# EAGLE schematic led-regulator (EAGLE 6.4)
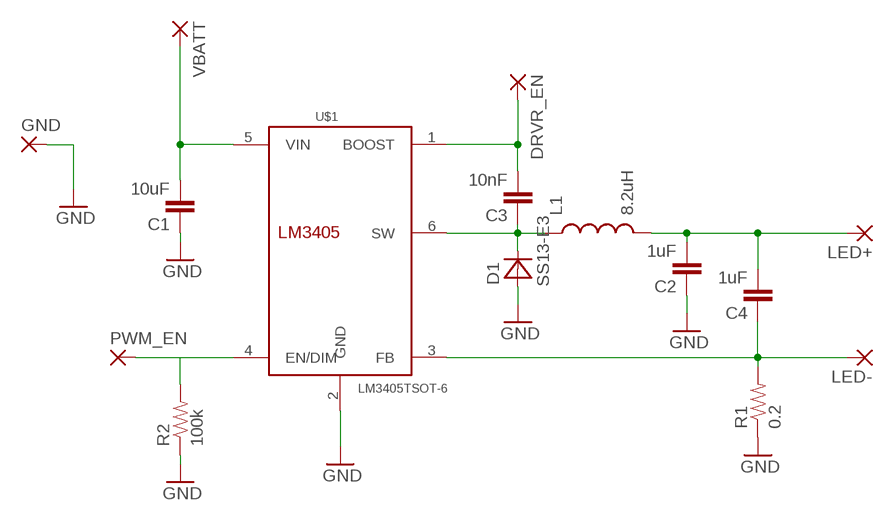
[diagram p0: schematic, sheet 1]

## Parts
C1  10uF  CAP1206  [1206]
C2  1uF  CAP1206  [1206]
C3  10nF  CAP0805  [0805]
C4  1uF  CAP0805  [0805]
D1  SS13-E3  MBRA340T3  [SMA]
DRVR_EN  WIREPAD2,15/1,0  [2,15/1,0]
GND  WIREPAD2,15/1,0  [2,15/1,0]
L1  8.2uH  INDUCTOR1210  [1210]
LED+  WIREPAD2,15/1,0  [2,15/1,0]
LED-  WIREPAD2,15/1,0  [2,15/1,0]
PWM_EN  WIREPAD2,15/1,0  [2,15/1,0]
R1  0.2  RESISTOR2010  [R2010]
R2  100k  RESISTOR1206  [1206]
U$1  LM3405TSOT-6  [TSOT-6]
VBATT  WIREPAD2,15/1,0  [2,15/1,0]

## Nets
GND: C1.1 C2.1 D1.A GND.1(P) R1.1 R2.1 U$1.2(GND)
N$1: C3.2 DRVR_EN.1(P) U$1.1(BOOST)
N$2: C4.1 LED-.1(P) R1.2 U$1.3(FB)
N$3: PWM_EN.1(P) R2.2 U$1.4(EN/DIM)
N$4: C3.1 D1.C L1.1 U$1.6(SW)
N$5: C2.2 C4.2 L1.2 LED+.1(P)
VBATT: C1.2 U$1.5(VIN) VBATT.1(P)

## Library data of the parts
C1-C4 = SparkFun-Capacitors:CAP: Capacitor Standard 0603 ceramic capacitor, and 0.1" leaded capacitor.
D1 = diode:MBRA340T3: Surface Mount Schottky Power Rectifier Source: http://www.onsemi.com/pub_link/Collateral/MBRA340T3-D.PDF
DRVR_EN GND LED+ LED- PWM_EN VBATT = wirepad:WIREPAD: Wire PAD connect wire on PCB
L1 = SparkFun-Passives:INDUCTOR: Inductors Basic Inductor/Choke - 0603 and 1206. Footprints are not proven and vary greatly between part numbers.
R1 R2 = SparkFun-Passives:RESISTOR: Resistor Basic schematic elements and footprints for 0603, 1206, and PTH resistors.
U$1 = Synapseware:LM3405: LM3405 1.6MHz, 1A Constant Current Buck Regulator for Powering LEDs